# Altium schematic sheet Sheet1.SchDoc
size A4; SheetNumber: 1; SheetTotal: 2
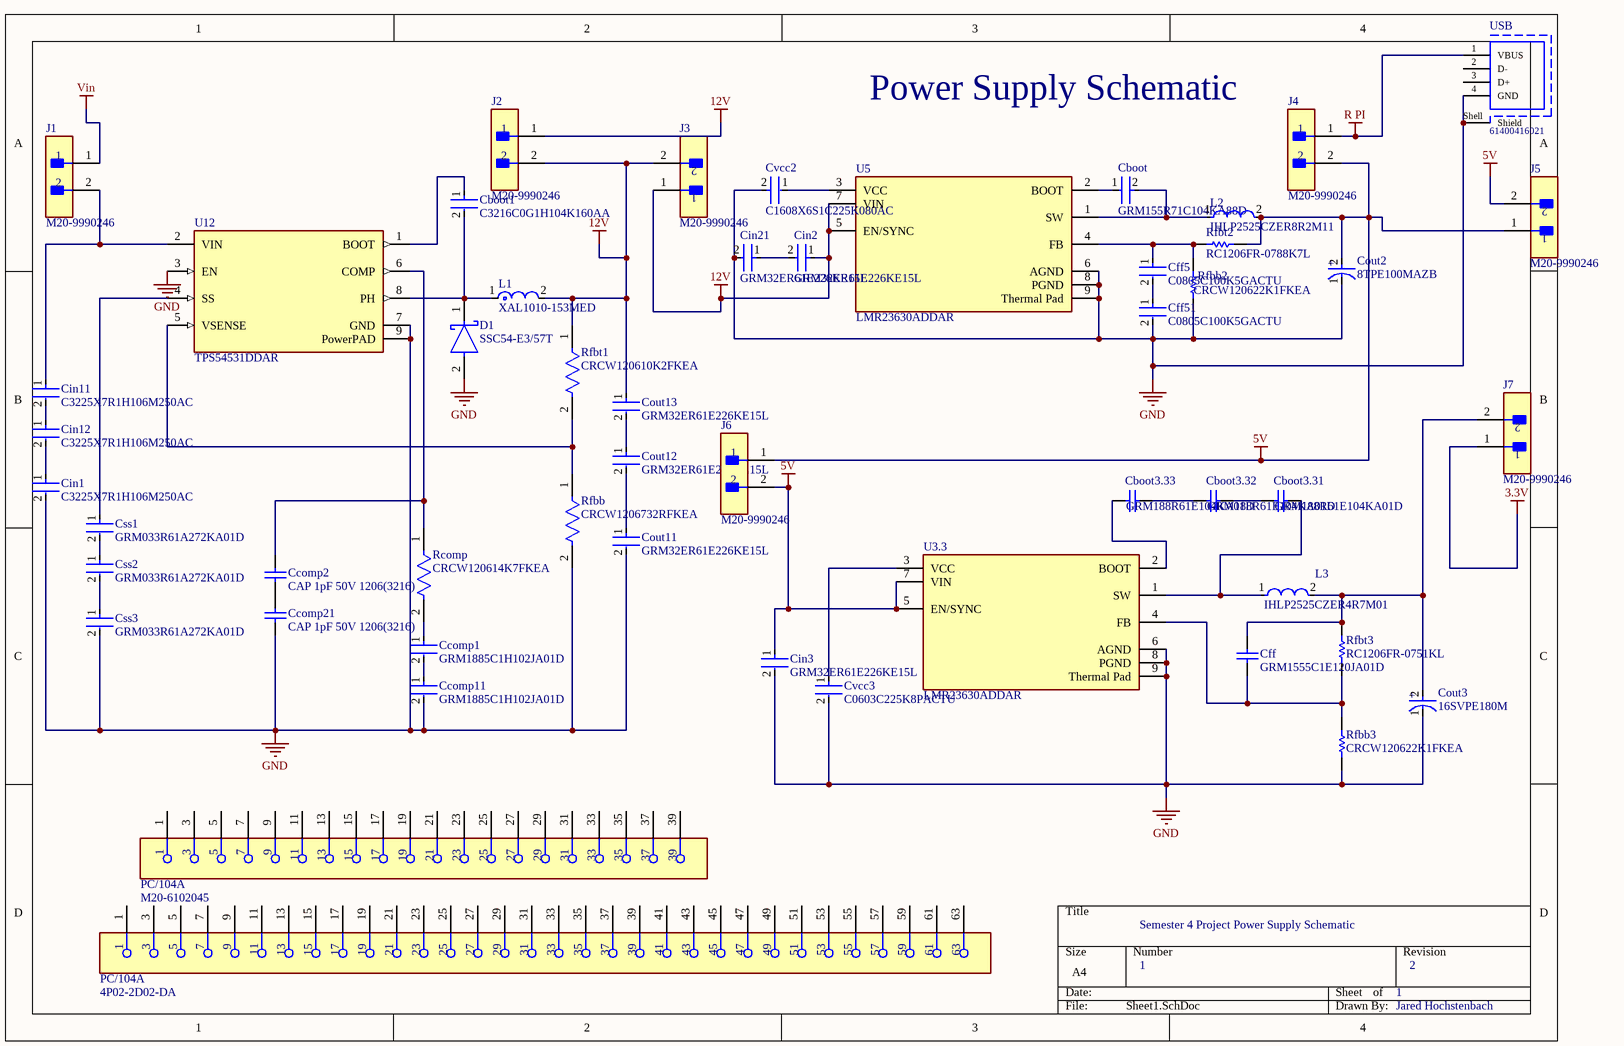
[diagram p0: Sheet1.SchDoc]

## Parts
(Parts that share a designator on the sheet are numbered #1, #2 ... from top to bottom, then left to right.)
Cboot  GRM155R71C104KA88D  [FP-GRM15-MFG]
Cboot1  C3216C0G1H104K160AA  [FP-C3216-160-0_2-IPC_C]
Cboot3.31  GRM188R61E104KA01D  [CAPC1608X90X35NL10T15]
Cboot3.32  GRM188R61E104KA01D  [CAPC1608X90X35NL10T15]
Cboot3.33  GRM188R61E104KA01D  [CAPC1608X90X35NL10T15]
Ccomp1  GRM1885C1H102JA01D  [FP-GRM188-0_1-e0_2_0_5-IPC_C]
Ccomp2  CAP 1pF 50V 1206(3216)  [CAPC1206(3216)100_N]
Ccomp11  GRM1885C1H102JA01D  [FP-GRM188-0_1-e0_2_0_5-IPC_C]
Ccomp21  CAP 1pF 50V 1206(3216)  [CAPC1206(3216)100_N]
Cff  GRM1555C1E120JA01D  [CAPC1005X55X25LL05T10]
Cff5  C0805C100K5GACTU  [FP-C0805C-DN-MFG]
Cff51  C0805C100K5GACTU  [FP-C0805C-DN-MFG]
Cin1  C3225X7R1H106M250AC  [FP-C3225-250-0_4-MFG]
Cin2  GRM32ER61E226KE15L  [FP-GRM32-MFG]
Cin3  GRM32ER61E226KE15L  [FP-GRM32-MFG]
Cin11  C3225X7R1H106M250AC  [FP-C3225-250-0_4-MFG]
Cin12  C3225X7R1H106M250AC  [FP-C3225-250-0_4-MFG]
Cin21  GRM32ER61E226KE15L  [FP-GRM32-MFG]
Cout2  8TPE100MAZB  [FP-POSCAP-B2-MFG]
Cout3  16SVPE180M  [FP-OS-CON-SMT-C10-MFG]
Cout11  GRM32ER61E226KE15L  [FP-GRM32-MFG]
Cout12  GRM32ER61E226KE15L  [FP-GRM32-MFG]
Cout13  GRM32ER61E226KE15L  [FP-GRM32-MFG]
Css1  GRM033R61A272KA01D  [FP-GRM033-0_03-IPC_B]
Css2  GRM033R61A272KA01D  [FP-GRM033-0_03-IPC_B]
Css3  GRM033R61A272KA01D  [FP-GRM033-0_03-IPC_B]
Cvcc2  C1608X6S1C225K080AC  [FP-C1608-080-0_1-IPC_A]
Cvcc3  C0603C225K8PACTU  [FP-C0603C225K8PACTU-MFG]
D1  SSC54-E3/57T  [FP-95402-MFG]
J1  M20-9990246  [FP-M20-9990246-MFG]
J2  M20-9990246  [FP-M20-9990246-MFG]
J3  M20-9990246  [FP-M20-9990246-MFG]
J4  M20-9990246  [FP-M20-9990246-MFG]
J5  M20-9990246  [FP-M20-9990246-MFG]
J6  M20-9990246  [FP-M20-9990246-MFG]
J7  M20-9990246  [FP-M20-9990246-MFG]
L1  XAL1010-153MED  [FP-XAL1010-MFG]
L2  IHLP2525CZER8R2M11  [FP-IHLP-2525CZ-FP_2_413x3-MFG]
L3  IHLP2525CZER4R7M01  [FP-IHLP-2525CZ-FP_2_413x3-MFG]
PC/104#1  M20-6102045  [FP-M20-6102045-MFG]  (part A of 2)
PC/104#2  4P02-2D02-DA  [FP-4P02-2D02-DA-MFG]  (part A of 2)
Rcomp  CRCW120614K7FKEA  [FP-CRCW1206-e3-MFG]
Rfbb  CRCW1206732RFKEA  [FP-CRCW1206-e3-IPC_B]
Rfbb2  CRCW120622K1FKEA  [RESC3216X60X45ML10T20]
Rfbb3  CRCW120622K1FKEA  [RESC3216X60X45ML10T20]
Rfbt1  CRCW120610K2FKEA  [FP-CRCW1206-e3-MFG]
Rfbt2  RC1206FR-0788K7L  [RESC3116X65X40LL10T20]
Rfbt3  RC1206FR-0751KL  [RESC3116X65X40NL10T20]
U3.3  LMR23630ADDAR  [FP-DDA0008E-MFG]
U5  LMR23630ADDAR  [FP-DDA0008E-MFG]
U12  TPS54531DDAR  [FP-DDA0008E-MFG]
USB  61400416021  [61400416021]

## Nets
3.3V: J7.1
5V: Cin3.1 Cout2.2(A) J4.2 J5.1 J5.2 J6.1 J6.2 L2.2 Rfbt2.2 U3.3.5(EN/SYNC) U3.3.7(VIN)
12V: Cin2.1 Cout13.1 J2.1 J2.2 J3.1 J3.2 L1.2 Rfbt1.1 U5.5(EN/SYNC) U5.7(VIN)
GND: Ccomp11.2 Ccomp21.1 Cff51.2 Cin1.2 Cin3.2 Cin21.2 Cout2.1(C) Cout3.1(C) Cout11.2 Css3.2 Cvcc2.2 Cvcc3.2 D1.2(A) Rfbb.2 Rfbb2.2 Rfbb3.1 U3.3.6(AGND) U3.3.8(PGND) U3.3.9(Thermal_Pad) U5.6(AGND) U5.8(PGND) U5.9(Thermal_Pad) U12.3(EN) U12.7(GND) U12.9(PowerPAD) USB.4(GND) USB.Shell(Shield)
R PI: J4.1 USB.1(VBUS)
Vin: J1.1
NetCboot1_1: Cboot1.1 U12.1(BOOT)
NetCboot1_2: Cboot1.2 D1.1(C) L1.1 U12.8(PH)
NetCboot3.31_1: Cboot3.31.1 Cboot3.32.2
NetCboot3.31_2: Cboot3.31.2 L3.1 U3.3.1(SW)
NetCboot3.32_1: Cboot3.32.1 Cboot3.33.2
NetCboot3.33_1: Cboot3.33.1 U3.3.2(BOOT)
NetCboot_1: Cboot.1 U5.2(BOOT)
NetCboot_2: Cboot.2 L2.1 U5.1(SW)
NetCcomp1_1: Ccomp1.1 Rcomp.2
NetCcomp1_2: Ccomp1.2 Ccomp11.1
NetCcomp2_1: Ccomp2.1 Ccomp21.2
NetCcomp2_2: Ccomp2.2 Rcomp.1 U12.6(COMP)
NetCff5_1: Cff5.1 Rfbb2.1 Rfbt2.1 U5.4(FB)
NetCff5_2: Cff5.2 Cff51.1
NetCff_1: Cff.1 Rfbb3.2 Rfbt3.1 U3.3.4(FB)
NetCff_2: Cff.2 Cout3.2(A) J7.2 L3.2 Rfbt3.2
NetCin1_1: Cin1.1 Cin12.2
NetCin2_2: Cin2.2 Cin21.1
NetCin11_1: Cin11.1 J1.2 U12.2(VIN)
NetCin11_2: Cin11.2 Cin12.1
NetCout11_1: Cout11.1 Cout12.2
NetCout12_1: Cout12.1 Cout13.2
NetCss1_1: Css1.1 U12.4(SS)
NetCss1_2: Css1.2 Css2.1
NetCss2_2: Css2.2 Css3.1
NetCvcc2_1: Cvcc2.1 U5.3(VCC)
NetCvcc3_1: Cvcc3.1 U3.3.3(VCC)
NetRfbb_1: Rfbb.1 Rfbt1.2 U12.5(VSENSE)

Not connected (* = marked no-connect by the designer): PC/104#1 1 3 5 7 9 11 13 15 17 19 21 23 25 27 29 31 33 35 37 39; PC/104#2 1 3 5 7 9 11 13 15 17 19 21 23 25 27 29 31 33 35 37 39 41 43 45 47 49 51 53 55 57 59 61 63; USB 2(D-) 3(D+)

## Notes on the sheet
- Power Supply Schematic
- Semester 4 Project Power Supply Schematic
- 1
- 2
- Jared Hochstenbach
- (in symbol CMP-05428-000600-1) +
- (in symbol CMP-05428-001341-1) +

## Library data of the parts
Cboot = CMP-2100-03641-2: CAP CER 0.1UF 16V X7R 0402; Manufacturer: Murata; Standoff Height: 0mm; Tolerance: 10%; Voltage Rating: 16Vdc; Capacitance: 0.10μF; Value: 0.10μF; RoHS: TRUE; Manufacturer Part Number: GRM155R71C104KA88D; Temperature Characteristic: X7R; Octopart: https://octopart.com/grm155r71c104ka88d-murata-196880; Digikey Description: CAP CER 0.1UF 16V X7R 0402; Device Class L3: Ceramic Capacitors; Height: 0.55mm; ComponentLink2Description: Datasheet; Temperature Range Low: -55°C; Ipc Land Pattern Name: CAPC10050X219; ComponentLink2URL: https://search.murata.co.jp/Ceramy/image/img/A01X/G101/ENG/GRM155R71H471KA01-01A.pdf; Device Class L1: Passive Components; Lead Free: yes; Category: Cap; Package: GRM15; Temperature: -55°C to +125°C; Device Class L2: Capacitors; Material: Ceramic; Temperature Range High: +125°C; Mouser Description: 0402 0.1 uF 16V ±10 % Tolerance X7R SMT Multilayer Ceramic Capacitor
Cboot1 = CMP-08246-004826-1: Multilayer Ceramic Capacitors 100nF ±10% 50V C0G SMD 1206; Min Operating Temperature: -55°C; Voltage Rating (DC): 50V; Package Quantity: 2000; Termination: SMD/SMT; Width: 0.063inch; Voltage Rating: 50V; Length: 0.126inch; Height: 1.6mm; Case/Package: 1206; Weight: 0.000571oz; Capacitance: 100nF; Dielectric Material: Ceramic; Max Operating Temperature: 125°C; Series: C; Mount: Surface Mount; Case Code (Imperial): 1206; Lead Free: Lead Free; Tolerance: 10%; Case Code (Metric): 3216; RoHS Compliant: Yes; Dielectric: C0G; Packaging: Tape and Reel; Thickness: 0.071inch
Cboot3.31-Cboot3.33 = CMP-2006-02508-1: Manufacturer: Murata; Part Number: GRM188R61E104KA01D
Ccomp1 Ccomp11 = CMP-1662-00022-2: Chip Multilayer Ceramic Capacitors for General Purpose, 0603, 1000pF, C0G, 30ppm/°C, 5%, 50V; Insulation Resistance: 10GR; Capacitance: 1nF; Number of Pins: 2; REACH SVHC: No SVHC; Width: 0.8mm; Tolerance: 5%; Termination: SMD/SMT; Thickness: 0.035inch; Height: 0.8mm; Case Code (Imperial): 0603; Length: 1.6mm; Voltage Rating: 50V; Voltage Rating (DC): 50V; Temperature Coefficient: 30ppm/°C; Mount: Surface Mount; Lead Free: Lead Free; Max Operating Temperature: 125°C; Min Operating Temperature: -55°C; Packaging: Tape and Reel; Dielectric: C0G; Voltage: 50V; Package Quantity: 1; Material: Ceramic; Case Code (Metric): 1608; Radiation Hardening: No; Depth: 0.8mm; Case/Package: 0603; Dielectric Material: Ceramic
Ccomp2 Ccomp21 = CMP-1037-00024-1: CAP 1pF 50V ±0.25pF 1206 (3216 Metric) Thickness 1mm SMD; Case-EIA: 1206; Tolerance: Â±0.25pF; Case-Metric: 3216; Rated Voltage: 50 V; Technology: SMT; Value: 1pF; Max Thickness: 1 mm
Cff = CMP-2008-03987-1: Manufacturer: Murata; Part Number: GRM1555C1E120JA01D
Cff5 Cff51 = CMP-2007-00462-2: CAP CER 10PF 50V 10% NP0 0805; Manufacturer: KEMET; Temperature Characteristic: C0G; Temperature Coefficient: 30ppm/°C; Tolerance: 0.1; Package: C0805C-DN; Device Class L2: Capacitors; Mouser Description: Multilayer Ceramic Capacitors MLCC - SMD/SMT 50volts 10pF C0G 10%; ComponentLink2URL: https://content.kemet.com/datasheets/KEM_C1003_C0G_SMD.pdf; Automotive: No; Device Class L3: Ceramic Capacitors; Temperature: -55°C to +125°C; Manufacturer Part Number: C0805C100K5GACTU; Digikey Description: CAP CER 10PF 50V 10% NP0 0805; Material: Ceramic; RoHS: TRUE; Temperature Range High: +125°C; Value: 10 pF; Capacitance: 10 pF; Category: Cap; Voltage Rating: 50 V; Octopart: https://octopart.com/c0805c100k5gactu-kemet-8089747; Height: 0.88mm; Lead Free: Yes; Ipc Land Pattern Name: CAPC200125X78; Temperature Range Low: -55°C; Device Class L1: Passive Components; ComponentLink2Description: Datasheet
Cin1 Cin11 Cin12 = CMP-08246-002653-1: Multilayer Ceramic Capacitors 10uF ±20% 50V X7R SMD 1210; Width: 0.098inch; Package Quantity: 1000; Height: 2.5mm; Dielectric Material: Ceramic; Voltage Rating: 50V; Series: C; Capacitance: 10uF; Tolerance: 20%; Weight: 0.000564oz; Case/Package: 1210; Case Code (Imperial): 1210; Dielectric: X7R; Case Code (Metric): 3225; REACH SVHC: No SVHC; Packaging: Tape and Reel; Length: 0.126inch; Termination: SMD/SMT; Min Operating Temperature: -55°C; Voltage Rating (DC): 50V; Lead Free: Lead Free; Max Operating Temperature: 125°C; Thickness: 0.11inch; Mount: Surface Mount
Cin2 Cin3 Cin21 Cout11-Cout13 = CMP-2000-05458-2: CAP CER 22UF 25V X5R 1210; Manufacturer: Murata Electronics North America; Possible Substitute: GRM32ER61E226KE15K; Other Names: 490-3889-2; Tolerance: 10%; Digikey Description: CAP CER 22UF 25V X5R 1210; Mouser Description: Multilayer Ceramic Capacitors MLCC - SMD/SMT 1210 22uF 25volts X5R 10%; Device Class L2: Capacitors; Height: 2.7mm; Temperature Characteristic: X5R; Category: Cap; RoHS: TRUE; Operating Temperature: -55°C ~ 85°C; Temperature: -55°C to +85°C; Lead Free: Yes; Package: GRM32; Temperature Range High: +85°C; Package / Case: 1210 (3225 Metric); Standard Package: 1,000; Packaging: Cut Tape (CT); Material: Ceramic; Capacitance: 22uF; Thickness (Max): 0.106" (2.70mm); Value: 22uF; Automotive: No; Device Class L1: Passive Components; Voltage - Rated: 25V; Temperature Range Low: -55°C; Size / Dimension: 0.126" L x 0.098" W (3.20mm x 2.50mm); ComponentLink2Description: Datasheet; Device Class L3: Ceramic Capacitors; Temperature Coefficient: X5R; ComponentLink2URL: https://search.murata.co.jp/Ceramy/image/img/A01X/G101/ENG/GRM32ER61E226KE15-01A.pdf; Voltage Rating: 25V; Manufacturer Part Number: GRM32ER61E226KE15L; Octopart: https://octopart.com/grm32er61e226ke15l-murata-197441; Applications: General Purpose; Mounting Type: Surface Mount, MLCC
Cout2 = CMP-05428-001341-1: Molded Tantalum Polymer Capacitor 100uF 20% 8V life 1000Hours SMD 1411; Ripple Current: 1.4A; Polarity: Polar; ESR (Equivalent Series Resistance): 35mR; Leakage Current: 80uA; Dissipation Factor: 8%; Number of Pins: 2; Mount: Surface Mount; Lead Free: Lead Free; Min Operating Temperature: -55°C; Height - Seated (Max): 0.079inch; Tolerance: 20%; Voltage Rating (DC): 8V; Series: POSCAP™ TPE; RoHS Compliant: Yes; Features: General Purpose; Length: 3.5mm; Depth: 2.8mm; Termination: SMD/SMT; Height: 1.9mm; Radiation Hardening: No; Width: 2.8mm; Capacitance: 100uF; Voltage Rating: 8V; Construction: Flat; Case/Package: Molded; Package Quantity: 2000; Voltage: 8V; Max Operating Temperature: 105°C; Case Code (Imperial): 1210; Case Code (Metric): 3528; Packaging: Tape and Reel; REACH SVHC: No SVHC
Cout3 = CMP-05428-000600-1: CAP ALUM POLY 180UF 20% 16V SMD; Dissipation Factor: 12%; Ripple Current: 4.46A; ESR (Equivalent Series Resistance): 11mR; Polarity: Polar; Leakage Current: 576uA; Life (Hours): 2000Hour; Voltage: 16V; Termination: SMD/SMT; Number of Pins: 10; REACH SVHC: No SVHC; Capacitance: 180uF; Packaging: Tape and Reel; Case/Package: Radial; Lead Free: Lead Free; Construction: Cylindrical; Height - Seated (Max): 0.394inch; Min Operating Temperature: -55°C; Diameter: 6.3mm; Tolerance: 20%; Max Operating Temperature: 105°C; Series: OS-CON™, SVPE; Package Quantity: 500; Voltage Rating: 16V; Mount: Surface Mount; Length: 9.9mm; Ripple Current (AC): 4.46A; Height: 9.9mm; Radiation Hardening: No; RoHS Compliant: Yes; Voltage Rating (DC): 16V
Css1-Css3 = CMP-2010-01672-2: Chip Multilayer Ceramic Capacitors for General Purpose, 0201, 2700pF, X5R, 15%, 10%, 10V; Capacitance: 2.7nF; Max Operating Temperature: 85°C; Packaging: Tape and Reel; Tolerance: 10%; Radiation Hardening: No; Case/Package: 0201; Depth: 0.3mm; Length: 0.6mm; Voltage Rating (DC): 10V; Package Quantity: 15000; Lead Free: Lead Free; Case Code (Metric): 0603; Termination: SMD/SMT; Mount: Surface Mount; Voltage Rating: 10V; Height: 0.3mm; Min Operating Temperature: -55°C; Dielectric: X5R; Thickness: 0.013inch; Width: 0.012inch; Case Code (Imperial): 0201
Cvcc2 = CMP-08246-003448-1: Multilayer Ceramic Capacitors 2.2μF ±10% 16V X6S SMD 0603; Capacitance: 2.2uF; Length: 1.6mm; Min Operating Temperature: -55°C; Voltage Rating: 16V; Packaging: Tape and Reel; Mount: Surface Mount; Case Code (Metric): 1608; Tolerance: 10%; Construction: Flat; Dielectric: X6S; Width: 0.031inch; Max Operating Temperature: 105°C; Series: C; Case/Package: 0603; Case Code (Imperial): 0603; Dielectric Material: Ceramic; Thickness: 0.035inch; Depth: 0.8mm; Package Quantity: 1; Lead Free: Lead Free; Height: 0.8mm; RoHS Compliant: Yes; Voltage Rating (DC): 16V
Cvcc3 = CMP-2006-02258-2: CAP CER 2.2UF 10V X5R 0603; Tolerance: 10%; Dissipation Factor: 5%; Dielectric Material: Ceramic; Series: C; Radiation Hardening: No; Termination: SMD/SMT; Height: 0.8mm; RoHS Compliant: Yes; Lead Pitch: 0.7mm; Length: 1.6mm; Construction: Flat; Capacitance: 2.2uF; Depth: 0.8mm; Voltage Rating (DC): 10V; Voltage: 10V; Case Code (Metric): 1608; Thickness: 0.035inch; Mount: Surface Mount; Min Operating Temperature: -55°C; Case Code (Imperial): 0603; Max Operating Temperature: 85°C; REACH SVHC: No SVHC; Packaging: Tape and Reel; Width: 0.031inch; Voltage Rating: 10V; Package Quantity: 1; Case/Package: 0603; Number of Pins: 2; Lead Free: Lead Free; Dielectric: X5R
D1 = CMP-02539-000015-1: DIODE SCHOTTKY 40V 5A DO214AB; Manufacturer: Vishay; Max Surge Forward Current: 175A; Max Junction Temp: +150°C; Peak Reverse Current: 0.5mA; Standoff Height: 0mm; Manufacturer Part Number: SSC54-E3/57T; Octopart: https://octopart.com/ssc54-e3%2F57t-vishay-39552944; Footprint Url: https://www.vishay.com/docs/95402/smc.pdf; Temperature Range Low: -65°C; RoHS: TRUE; Device Class L3: Schottky Diodes; Temperature: -65°C to +150°C; ComponentLink2URL: http://www.vishay.com/docs/88885/ssc53l.pdf; Device Class L2: Diodes; Device Class L1: Discrete Semiconductors; Reverse Voltage: 40V; Forward Current: 5A; Category: Diode; Height: 2.62mm; Automotive: No; Package: 95402; Max Repetitive Reverse Voltage: 40V; Lead Free: Yes; ComponentLink2Description: Datasheet; Temperature Range High: +150°C; Digikey Description: DIODE SCHOTTKY 40V 5A DO214AB; Mouser Description: SSC54 Series 40 V 5 A Surface Mount Schottky Rectifier - DO-214AB
J1-J7 = CMP-15831-000009-1: CONN HEADER VERT 2POS 2.54MM; Manufacturer: Harwin; Conn Gender: Male; Conn Orientation: Vertical; Number Of Contacts: 2; Current Rating: 3A; ComponentLink2URL: https://cdn.harwin.com/pdfs/M20-999.pdf; ComponentLink2Description: Datasheet; Package: M20-9990246; Temperature: -40°C to +105°C; Octopart: https://octopart.com/m20-9990246-harwin-2590635; Mouser Description: 2.54mm (0.1") Pitch SIL Vertical PC Tail Pin Header, 6.1mm mating pin height, tin, 2 contacts; Temperature Range High: +105°C; Device Class L1: Connectors; RoHS: TRUE; Automotive: No; Height: 8.99mm; Number Of Rows: 1; Contact Material: Tin,Nickel; Category: Conn; Pitch: 2.54mm; Lead Free: Yes; Digikey Description: CONN HEADER VERT 2POS 2.54MM; Manufacturer Part Number: M20-9990246; Temperature Range Low: -40°C; Device Class L3: unset; Device Class L2: Headers and Wire Housings
L1 = CMP-11268-000117-1: Fixed Inductors 15uH Shld 20% 13.8A 18.6mOhms AECQ2; Test Frequency: 100kHz; DC Resistance (DCR): 18.6mR; Saturation Current: 15.5A; Core Material: Composite; Self Resonant Frequency: 9MHz; Shielding: Shielded; REACH SVHC: No SVHC; Width: 10.5mm; Package Quantity: 300; Max Operating Temperature: 125°C; Tolerance: 20%; Length: 11.8mm; Inductance: 15uH; Mount: Surface Mount; Height: 10mm; Case/Package: SMD/SMT; Min Operating Temperature: -40°C; RoHS Compliant: Yes; Lead Free: Contains Lead; RMS Current (Irms): 13.8A; Termination: SMD/SMT; Packaging: Tape and Reel; Max DC Current: 13.8A; Inductance Tolerance: 20%; Series: XAL1010
L2 = CMP-02424-000138-1: Commercial Inductors, Low DCR Series 8.2uH 5A 54.9mΩ 20%; Core Material: Metal; Self Resonant Frequency: 1MHz; DC Resistance (DCR): 54.9mR; Test Frequency: 100kHz; Shielding: Shielded; Saturation Current: 4A; Military Standard: Not; Length: 0.27inch; Tolerance: 20%; Min Operating Temperature: -55°C; Height: 3mm; Package Quantity: 2000; Number of Pins: 2; Max Operating Temperature: 125°C; Radiation Hardening: No; Lead Free: Lead Free; Termination: SMD/SMT; Max DC Current: 5A; Depth: 6.72mm; Case/Package: 2525; Inductance Tolerance: 20%; Packaging: Tape and Reel; Inductance: 8.2uH; Mount: Surface Mount; RMS Current (Irms): 5A; Width: 0.255inch; Current Rating: 5A
L3 = CMP-02424-000538-1: Commercial Inductors, High Saturation Series 4.7uH 5.5A 40mΩ 20%; DC Resistance (DCR): 40mR; Max DC Current: 10A; Shielding: Shielded; Test Frequency: 100kHz; Self Resonant Frequency: 5MHz; Core Material: Metal; Height: 3mm; Depth: 6.72mm; Inductance Tolerance: 20%; Inductance: 4.7uH; Number of Pins: 2; Military Standard: Not; Min Operating Temperature: -55°C; Mount: Surface Mount; Saturation Current: 10A; Case/Package: 2525; Case Code (Metric): 6363; Packaging: Tape and Reel; Width: 0.255inch; Current Rating: 5.5A; Package Quantity: 2000; Termination: SMD/SMT; Case Code (Imperial): 2525; Lead Free: Lead Free; Contact Plating: Tin; Max Operating Temperature: 125°C; Tolerance: 20%; Length: 7.24mm; Radiation Hardening: No; Height - Seated (Max): 0.118inch; RMS Current (Irms): 5.5A
PC/104#1 = CMP-15831-000080-1: CONN STKTHRU PC/104 40POS PCB; Current Rating: 3A; Pitch: 2.54mm; Insulation Resistance: 5GR; Contact Resistance: 30mR; Number of Positions: 40; Gender: Receptacle; REACH SVHC: No SVHC; Housing Material: Nylon; Number of Rows: 2; Min Operating Temperature: -55°C; Contact Plating: Gold; Orientation: Straight; Mount: Through Hole; Contact Material: Bronze; Length: 51.46mm; Weight: 0.218205oz; Number of Contacts: 40; Packaging: Rail/Tube; Depth: 5.25mm; Termination: Solder; Radiation Hardening: No; Flammability Rating: UL94 V-0; Housing Color: Black; Max Operating Temperature: 105°C; Material: Nylon; Package Quantity: 11; Color: Black; Max Current Rating: 3A; Series: M20
PC/104#2 = CMP-05373-000001-1: CONN STKTHRU PC/104 64POS PCB; Gender: Receptacle; Contact Resistance: 20mR; Number of Contacts: 64; Pitch: 2.54mm; Current Rating: 3A; Case/Package: Module; Mount: Through Hole; Depth: 5.08mm; Max Operating Temperature: 105°C; Termination: Solder; Series: 4P02; Housing Material: Nylon; Number of Positions: 64; Packaging: Rail/Tube; Number of Rows: 2; Length: 81.98mm; Package Quantity: 665; Min Operating Temperature: -40°C; Orientation: Straight; RoHS Compliant: Yes; Max Current Rating: 3A; Flammability Rating: UL94 V-0; Contact Material: Bronze; Contact Plating: Gold
Rcomp = CMP-1014-00640-3: RES Thick Film, 14.7kΩ, 1%, 0.25W, 100ppm/°C, 1206; Voltage Rating: 200V; Max Power Dissipation: 250mW; Resistance: 14.7kR; Case Code (Imperial): 1206; Radiation Hardening: No; Contact Plating: Tin; Package Quantity: 10; Features: Automotive AEC-Q200; Military Standard: Not; Composition: Thick Film; Tolerance: 1%; Max Operating Temperature: 155°C; Min Operating Temperature: -55°C; Case Code (Metric): 3216; Height: 0.55mm; Packaging: Tape and Reel; Termination: SMD/SMT; Length: 3.2mm; Number of Terminations: 2; Voltage Rating (DC): 200V; Depth: 1.6mm; Power Rating: 250mW; Case/Package: 1206; Temperature Coefficient: 100ppm/°C; Lead Free: Lead Free; Weight: 0.000353oz; Width: 1.6mm
Rfbb = CMP-2003-02370-2: RES Thick Film, 732Ω, 1%, 0.25W, 100ppm/°C, 1206; Power Rating: 250mW; Resistance: 732R; Voltage Rating (DC): 200V; Case/Package: 1206; Height - Seated (Max): 0.024inch; Temperature Coefficient: 100ppm/°C; Number of Pins: 2; Tolerance: 1%; Number of Terminations: 2; Height: 0.024inch; Width: 1.6mm; Radiation Hardening: No; Weight: 0.000353oz; Depth: 1.6mm; Case Code (Metric): 3216; Package Quantity: 10; Min Operating Temperature: -55°C; Lead Free: Lead Free; Contact Plating: Tin; Packaging: Tape and Reel; Length: 3.2mm; Max Operating Temperature: 155°C; Features: Automotive AEC-Q200; Termination: SMD/SMT; Case Code (Imperial): 1206; Max Power Dissipation: 250mW; Composition: Thick Film; Military Standard: Not; Voltage Rating: 200V
Rfbb2 Rfbb3 = CMP-1014-00660-2: Manufacturer: Vishay Dale; Part Number: CRCW120622K1FKEA
Rfbt1 = CMP-1014-00624-3: RES Thick Film, 10.2kΩ, 1%, 0.25W, 100ppm/°C, 1206; Voltage Rating (DC): 200V; Power Rating: 250mW; Resistance: 10.2kR; Packaging: Tape and Reel; Composition: Thick Film; Width: 1.6mm; Termination: SMD/SMT; Weight: 0.000353oz; Contact Plating: Tin; Features: Automotive AEC-Q200; Depth: 1.6mm; Length: 3.2mm; Lead Free: Lead Free; Radiation Hardening: No; Tolerance: 1%; Max Power Dissipation: 250mW; Number of Pins: 2; Number of Terminations: 2; Case Code (Metric): 3216; Case/Package: 1206; Min Operating Temperature: -55°C; Case Code (Imperial): 1206; Voltage Rating: 200V; Height: 0.024inch; Temperature Coefficient: 100ppm/°C; Max Operating Temperature: 155°C; Package Quantity: 10; Military Standard: Not
Rfbt2 = CMP-2003-03890-1: Manufacturer: Yageo; Part Number: RC1206FR-0788K7L
Rfbt3 = CMP-2003-03796-1: Manufacturer: Yageo; Part Number: RC1206FR-0751KL
U3.3 U5 = CMP-04918-000336-1: IC REG BUCK ADJUSTABLE 3A 8SOPWR; Synchronous Rectifier: Yes; Min Output Voltage: 1V; Switching Frequency: 2.425MHz; Max Input Voltage: 36V; Output Configuration: Positive; Number of Outputs: 1; Min Input Voltage: 4V; Max Output Voltage: 28V; Quiescent Current: 75uA; Mount: Surface Mount; Min Operating Temperature: -40°C; Output Type: Adjustable; Packaging: Tape and Reel; Output Current: 3A; RoHS Compliant: Yes; Max Operating Temperature: 125°C; Lead Free: Lead Free; Number of Pins: 8
U12 = CMP-04918-000157-1: IC REG BUCK ADJUSTABLE 5A 8SOPWR; Switching Frequency: 570kHz; Output Configuration: Positive; Min Supply Voltage: 3.5V; Output Voltage: 25V; Max Input Voltage: 28V; Number of Outputs: 1; Min Output Voltage: 800mV; Max Output Voltage: 26.04V; Synchronous Rectifier: No; Quiescent Current: 110uA; Case/Package: SOIC; Number of Pins: 8; Package Quantity: 2500; Mount: Surface Mount; REACH SVHC: No SVHC; Min Operating Temperature: -40°C; Max Operating Temperature: 85°C; Max Output Current: 5A; Packaging: Tape and Reel; Lead Free: Lead Free; Output Type: Adjustable; Radiation Hardening: No; Output Current: 5A; Min Input Voltage: 3.5V; Operating Supply Voltage: 28V
USB = CMP-1502-03227-1: USB 2.0 Type A Receptacle WR-COM, Horizontal, THT; Manufacturer: Wurth Elektronik; Working Voltage: 30VAC; Rated Current: 1.5A; Contact Resistance: 20mOhm; Manufacturer URL: http://www.we-online.de; Publisher: WurthElektronik; Packaging: Tray; Operating Temperature: -40to105degC; Orientation: Horizontal; Mounting Technology: THT; Part Number: 61400416021; Gender: Receptacle; Package Reference: 61400416021; Connector Type: USB2.0TypeA; Datasheet URL: https://katalog.we-online.de/em/datasheet/61400416021.pdf